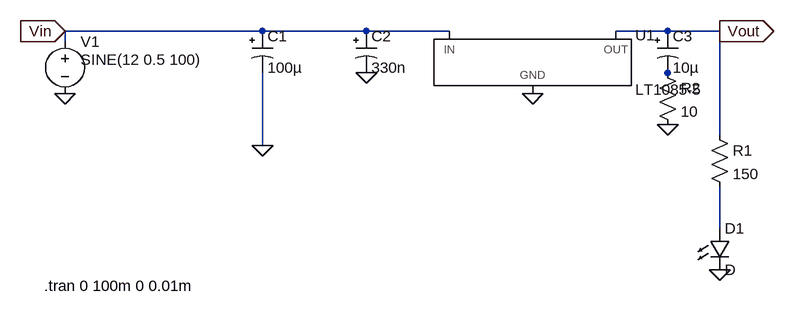
[diagram p0: schematic schema_ltspice_thermique.asc]
schema_ltspice_thermique.asc, the LTspice schematic file:
Version 4
SHEET 1 880 680
WIRE -176 144 -480 144
WIRE -16 144 -176 144
WIRE 112 144 -16 144
WIRE 448 144 368 144
WIRE 528 144 448 144
WIRE -480 160 -480 144
WIRE 448 208 448 192
WIRE 528 304 528 144
WIRE -176 320 -176 208
WIRE 528 448 528 384
FLAG -176 320 0
FLAG -480 240 0
FLAG 528 512 0
FLAG 528 144 Vout
IOPIN 528 144 Out
FLAG -480 144 Vin
IOPIN -480 144 In
FLAG -16 208 0
FLAG 448 288 0
FLAG 240 240 0
SYMBOL PowerProducts\\LT1085-5 240 144 R0
SYMATTR InstName U1
SYMBOL polcap -192 144 R0
WINDOW 3 24 56 Left 2
SYMATTR Value 100µ
SYMATTR InstName C1
SYMATTR Description Capacitor
SYMATTR Type cap
SYMATTR SpiceLine V=6.3 Irms=0 Rser=0.9 Lser=0 mfg="AVX" pn="TAJD107M006" type="Tantalum"
SYMBOL polcap -32 144 R0
WINDOW 3 24 56 Left 2
SYMATTR Value 330n
SYMATTR InstName C2
SYMATTR Description Capacitor
SYMATTR Type cap
SYMATTR SpiceLine V=6.3 Irms=0 Rser=0.9 Lser=0
SYMBOL polcap 432 144 R0
WINDOW 3 24 56 Left 2
SYMATTR Value 10µ
SYMATTR InstName C3
SYMATTR Description Capacitor
SYMATTR Type cap
SYMATTR SpiceLine V=6.3 Irms=0 Rser=4 Lser=0 mfg="AVX" pn="TAJA106M006" type="Tantalum"
SYMBOL res 512 288 R0
SYMATTR InstName R1
SYMATTR Value 150
SYMATTR SpiceLine tol=1 pwr=0.1
SYMBOL LED 512 448 R0
SYMATTR InstName D1
SYMBOL voltage -480 144 R0
WINDOW 3 24 44 Left 2
WINDOW 123 0 0 Left 0
WINDOW 39 0 0 Left 0
SYMATTR Value SINE(12 0.5 100)
SYMATTR InstName V1
SYMBOL res 432 192 R0
SYMATTR InstName R2
SYMATTR Value 10
TEXT -512 536 Left 2 !.tran 0 100m 0 0.01m

The netlist it stands for:
* schema_ltspice_thermique.asc
XU1 0 Vout Vin LT1085-5  ; pins GND OUT IN
C1 Vin 0 100µ V=6.3 Irms=0 Rser=0.9 Lser=0 mfg="AVX" pn="TAJD107M006" type="Tantalum"
C2 Vin 0 330n V=6.3 Irms=0 Rser=0.9 Lser=0
C3 Vout N001 10µ V=6.3 Irms=0 Rser=4 Lser=0 mfg="AVX" pn="TAJA106M006" type="Tantalum"
R1 Vout N002 150 tol=1 pwr=0.1
D1 N002 0 D
V1 Vin 0 SINE(12 0.5 100)
R2 N001 0 10
.model D D
.lib standard.dio
.tran 0 100m 0 0.01m
.backanno
.end